# Altium schematic sheet 02_GAP9_CHIP_POWER.SchDoc: GAP9Shield
size A3; DrawnBy: Hanna Müller and Victor Kartsch; Organization: Integrated Systems Laboratory; DocumentNumber: 2; Revision: v1.0; SheetNumber: 2; SheetTotal: 9
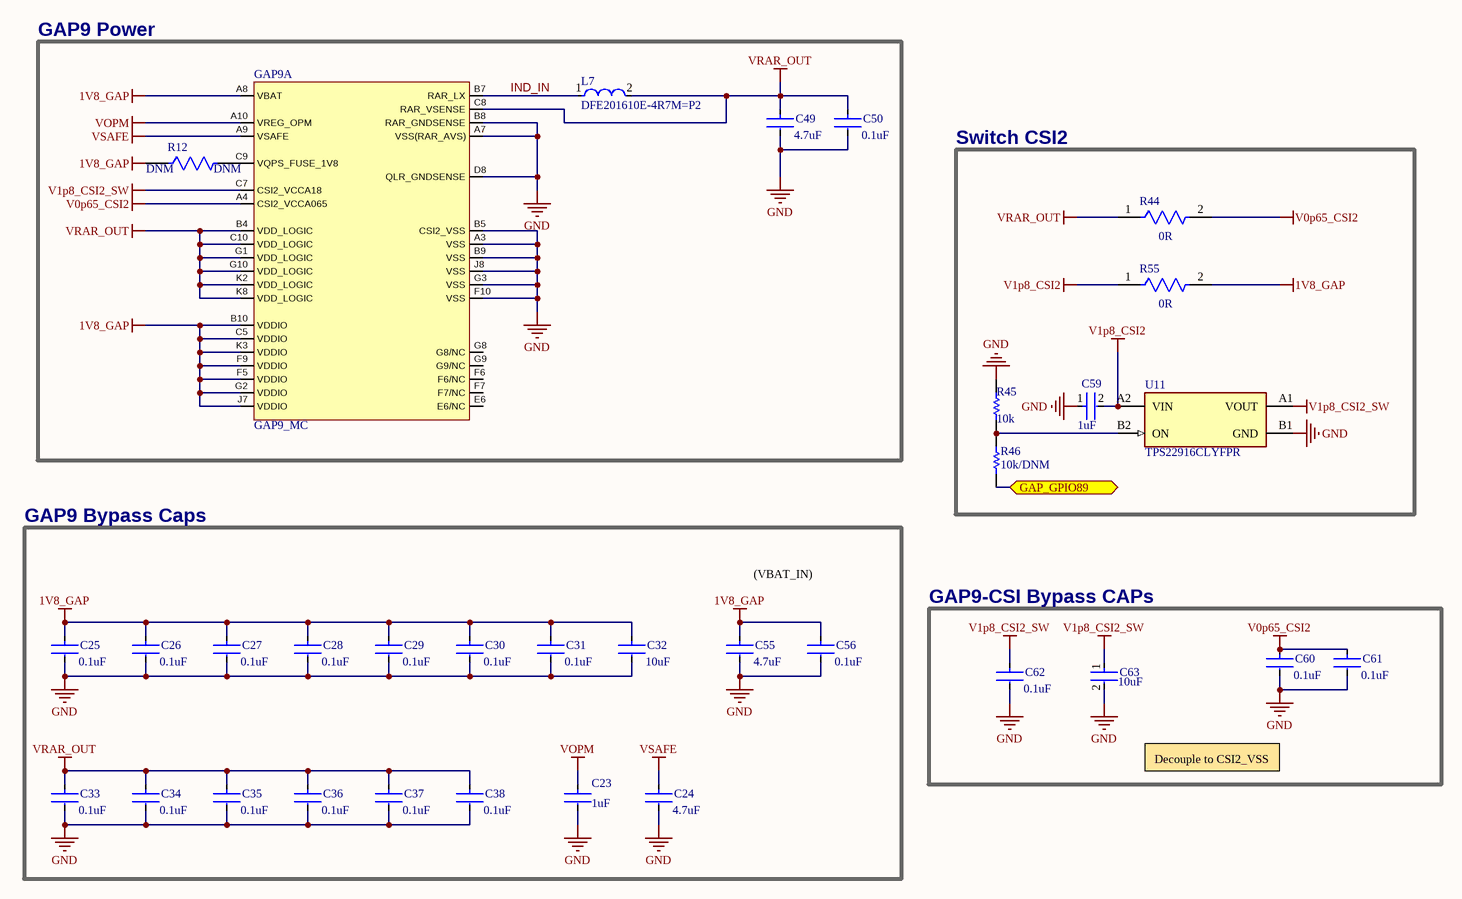
[diagram p0: 02_GAP9_CHIP_POWER.SchDoc]

## Parts
C23  Capacitance: 1uF  [FP-CL03-IPC_B]  (hidden comment: CL03A105KP3NSNC)
C24  Capacitance: 4.7uF  [FP-C1005-050-0_15-IPC_B]  (hidden comment: C1005X5R0J475K050BC)
C25  Capacitance: 0.1uF  [FP-GRM033-0_03-IPC_B]  (hidden comment: GRM033Z71C104KE14D)
C26  Capacitance: 0.1uF  [FP-GRM033-0_03-IPC_B]  (hidden comment: GRM033Z71C104KE14D)
C27  Capacitance: 0.1uF  [FP-GRM033-0_03-IPC_B]  (hidden comment: GRM033Z71C104KE14D)
C28  Capacitance: 0.1uF  [FP-GRM033-0_03-IPC_B]  (hidden comment: GRM033Z71C104KE14D)
C29  Capacitance: 0.1uF  [FP-GRM033-0_03-IPC_B]  (hidden comment: GRM033Z71C104KE14D)
C30  Capacitance: 0.1uF  [FP-GRM033-0_03-IPC_B]  (hidden comment: GRM033Z71C104KE14D)
C31  Capacitance: 0.1uF  [FP-GRM033-0_03-IPC_B]  (hidden comment: GRM033Z71C104KE14D)
C32  Capacitance: 10uF  [FP-CL05A106MP5NUNC-IPC_B]  (hidden comment: CL05A106MP5NUNC)
C33  Capacitance: 0.1uF  [FP-GRM033-0_03-IPC_B]  (hidden comment: GRM033Z71C104KE14D)
C34  Capacitance: 0.1uF  [FP-GRM033-0_03-IPC_B]  (hidden comment: GRM033Z71C104KE14D)
C35  Capacitance: 0.1uF  [FP-GRM033-0_03-IPC_B]  (hidden comment: GRM033Z71C104KE14D)
C36  Capacitance: 0.1uF  [FP-GRM033-0_03-IPC_B]  (hidden comment: GRM033Z71C104KE14D)
C37  Capacitance: 0.1uF  [FP-GRM033-0_03-IPC_B]  (hidden comment: GRM033Z71C104KE14D)
C38  Capacitance: 0.1uF  [FP-GRM033-0_03-IPC_B]  (hidden comment: GRM033Z71C104KE14D)
C49  Capacitance: 4.7uF  [FP-C1005-050-0_15-IPC_B]  (hidden comment: C1005X5R0J475K050BC)
C50  Capacitance: 0.1uF  [FP-GRM033-0_03-IPC_B]  (hidden comment: GRM033Z71C104KE14D)
C55  Capacitance: 4.7uF  [FP-C1005-050-0_15-IPC_B]  (hidden comment: C1005X5R0J475K050BC)
C56  Capacitance: 0.1uF  [FP-GRM033-0_03-IPC_B]  (hidden comment: GRM033Z71C104KE14D)
C59  value 1uF  [FP-GRM033-0_09-IPC_C]  (hidden comment: GRM033C81A105ME05D)
C60  Capacitance: 0.1uF  [FP-GRM033-0_03-IPC_B]  (hidden comment: GRM033Z71C104KE14D)
C61  Capacitance: 0.1uF  [FP-GRM033-0_03-IPC_B]  (hidden comment: GRM033Z71C104KE14D)
C62  Capacitance: 0.1uF  [FP-GRM033-0_03-IPC_B]  (hidden comment: GRM033Z71C104KE14D)
C63  value 10uF  [FP-CL05A106MP5NUNC-MFG]  (hidden comment: CL05A106MP5NUNC)
GAP9  GAP9_MC  [GAP9]  (part A of 5)
L7  DFE201610E-4R7M=P2  [FP-DFE201610C-MFG]
R12  DNM  [0402]
R44  value 0R  [FP-CRCW0402-C-e3-MFG]  (hidden comment: CRCW04020000Z0EDC)
R45  value 10k  [RESC0603X28X15LL05T05]  (hidden comment: CRCW020110K0FNED)
R46  value 10k/DNM  [RESC0603X28X15LL05T05]  (hidden comment: CRCW020110K0FNED)
R55  value 0R  [FP-CRCW0402-C-e3-MFG]  (hidden comment: CRCW04020000Z0EDC)
U11  TPS22916CLYFPR  [FP-YFP0004-IPC_C]

## Blocks framed on the sheet
GAP9 Power: C49 C50 GAP9 L7 R12
Switch CSI2: C59 R44-R46 R55 U11
GAP9 Bypass Caps: C23-C38 C55 C56
GAP9-CSI Bypass CAPs: C60-C63

## Ports
GAP_GPIO89 (bidir)

## Nets
1V8_GAP: C25.1 C26.1 C27.1 C28.1 C29.1 C30.1 C31.1 C32.1 C55.1 C56.1 GAP9.A8(VBAT) GAP9.B10(VDDIO) GAP9.C5(VDDIO) GAP9.F5(VDDIO) GAP9.F9(VDDIO) GAP9.G2(VDDIO) GAP9.J7(VDDIO) GAP9.K3(VDDIO) R12.1 R55.2
GND: C23.2 C24.2 C25.2 C26.2 C27.2 C28.2 C29.2 C30.2 C31.2 C32.2 C33.2 C34.2 C35.2 C36.2 C37.2 C38.2 C49.2 C50.2 C55.2 C56.2 C59.1 C60.2 C61.2 C62.2 C63.2 GAP9.A3(VSS) GAP9.A7(VSS(RAR_AVS)) GAP9.B5(CSI2_VSS) GAP9.B8(RAR_GNDSENSE) GAP9.B9(VSS) GAP9.D8(QLR_GNDSENSE) GAP9.F10(VSS) GAP9.G3(VSS) GAP9.J8(VSS) R45.2 U11.B1(GND)
V0p65_CSI2: C60.1 C61.1 GAP9.A4(CSI2_VCCA065) R44.2
V1p8_CSI2: C59.2 R55.1 U11.A2(VIN)
V1p8_CSI2_SW: C62.1 C63.1 GAP9.C7(CSI2_VCCA18) U11.A1(VOUT)
VOPM: C23.1 GAP9.A10(VREG_OPM)
VRAR_OUT: C33.1 C34.1 C35.1 C36.1 C37.1 C38.1 C49.1 C50.1 GAP9.B4(VDD_LOGIC) GAP9.C8(RAR_VSENSE) GAP9.C10(VDD_LOGIC) GAP9.G1(VDD_LOGIC) GAP9.G10(VDD_LOGIC) GAP9.K2(VDD_LOGIC) GAP9.K8(VDD_LOGIC) L7.2 R44.1
VSAFE: C24.1 GAP9.A9(VSAFE)
GAP_GPIO89: R46.2 ; port GAP_GPIO89
IND_IN: GAP9.B7(RAR_LX) L7.1
NetGAP9_C9: GAP9.C9(VQPS_FUSE_1V8) R12.2
NetR45_1: R45.1 R46.1 U11.B2(ON)

Not connected (* = marked no-connect by the designer): GAP9 E6(E6/NC) F6(F6/NC) F7(F7/NC) G8(G8/NC) G9(G9/NC)

## Notes on the sheet
- (VBAT_IN)
- Decouple to CSI2_VSS
- 1
- 2
- 3
- 4
- 5
- 6
- 7
- 8
- A
- B
- C
- D
- Project:
- Date:
- Drawing number:
- Rev:
- Format:
- A3
- Drawn by:
- Laboratory:
- Page
- Sheet:
- of
- File:

## Library data of the parts
C23 = CMP-13271-003594-1: Cap Ceramic 1uF 10V X5R ±10% Pad SMD 0201 +85°C T/R; Min Operating Temperature: -55°C; Mount: Surface Mount; Packaging: Cut Tape; Width: 0.012inch; Tolerance: 10%; Case Code (Imperial): 0201; Thickness: 0.013inch; Length: 0.024inch; Case/Package: 0201; Max Operating Temperature: 85°C; Voltage Rating: 10V; Case Code (Metric): 0603; value: 1uF
C24 C49 C55 = CMP-2000-05437-2: Chip Multilayer Ceramic Capacitors for General Purpose, 0402, 4.7uF; Voltage: 6.3V; Tolerance: 10%; Dielectric: X5R; Depth: 0.5mm; Height: 0.5mm; Dielectric Material: Ceramic; Length: 1mm; Termination: SMD/SMT; RoHS Compliant: Yes; Series: C; Case/Package: 0402; Lead Free: Lead Free; Mount: Surface Mount; Max Operating Temperature: 85°C; Min Operating Temperature: -55°C; value: 4.7uF
C25-C31 C33-C38 C50 C56 C60-C62 = CMP-06035-035508-1: Chip Multilayer Ceramic Capacitors for General Purpose, 0201, 0.10uF, X7R, 15%, 10%, 16V; value: 0.1uF; Case/Package: 0201
C32 C63 = CMP-13271-000002-1: CAP CER 10UF 10V X5R 0402; Manufacturer: Samsung; Temperature Coefficient: 15%; Tolerance: 20%; Material: Ceramic; Octopart: https://octopart.com/cl05a106mp5nunc-samsung-22457395; Voltage Rating: 10V; RoHS: TRUE; Height: 0.7mm; Digikey Description: CAP CER 10UF 10V X5R 0402; Automotive: No; Package: CL05A106MP5NUNC; Device Class L1: Passive Components; Temperature Range High: +85°C; ComponentLink2Description: Datasheet; Device Class L2: Capacitors; Temperature Characteristic: X5R; Manufacturer Part Number: CL05A106MP5NUNC; Temperature: -55°C to +85°C; ComponentLink2URL: http://www.samsungsem.com/kr/support/product-search/mlcc/__icsFiles/afieldfile/2019/05/10/19-CL05A106MP5NUNC.pdf; Device Class L3: Ceramic Capacitors; Category: Cap; Temperature Range Low: -55°C; Ipc Land Pattern Name: CAPC10050X50; Lead Free: Yes
  C32: Value: 10uF
  C63: Capacitance: 10uF
C59 = CMP-06035-000112-2: Chip Multilayer Ceramic Capacitors for General Purpose, 0201, 1.0uF, X6S, 22%, 20%, 10V; Length: 0.024inch; Case Code (Metric): 0603; Voltage Rating (DC): 10V; Packaging: Tape and Reel; Mount: Surface Mount; Voltage Rating: 10V; Dielectric: X6S; Width: 0.012inch; Min Operating Temperature: -55°C; Case/Package: 0201; Case Code (Imperial): 0201; Tolerance: 20%; Thickness: 0.015inch; Max Operating Temperature: 105°C; Capacitance: 1uF
L7 = CMP-06042-006199-1: Shielded Wirewound Inductor 4.7uH 20% 1100mA 0.288Ω 0806 (2016); value: 4.7 uH
R12 = RES DNM 0402: Resistor; Value: DNM
R44 R55 = CMP-02407-011555-1: RES 0 OHM JUMPER 1/16W 0402; Power Rating: 62.5mW; Min Operating Temperature: -55°C; RoHS Compliant: Yes; Length: 1mm; Lead Free: Lead Free; Resistor Type: Thick Film; Case/Package: Molded; Contact Plating: Tin; Resistance: 0R; Mount: Surface Mount; Max Operating Temperature: 155°C; Termination: Wraparound
R45 R46 = CMP-2004-00016-1: Manufacturer: Vishay Dale; Part Number: CRCW020110K0FNED
U11 = CMP-04910-000140-1: IC PWR SWITCH P-CHAN 1:1 4DSBGA; Output Configuration: High Side; Fault Protection: Reverse Current; Number of Outputs: 1; Max Output Current: 2A; Packaging: Tape and Reel; RoHS Compliant: Yes; Min Operating Temperature: -40°C; Number of Channels: 1; Max Operating Temperature: 85°C